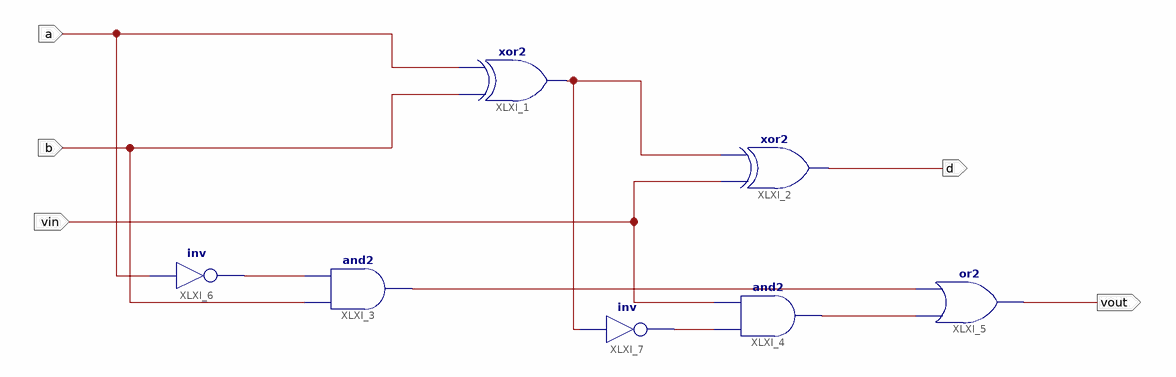
[diagram p0: schematic sheet 1]
// Xilinx ISE schematic optic.sch (spartan3e) as structural Verilog: 7 symbols, 5 ports
module optic (
  input  a,
  input  b,
  input  vin,
  output d,
  output vout
);

  wire XLXN_6, XLXN_8, XLXN_10, XLXN_11, XLXN_12;

  xor XLXI_1 (XLXN_10, b, a);
  xor XLXI_2 (d, vin, XLXN_10);
  and XLXI_3 (XLXN_8, b, XLXN_6);
  and XLXI_4 (XLXN_12, XLXN_11, vin);
  or XLXI_5 (vout, XLXN_12, XLXN_8);
  not XLXI_6 (XLXN_6, a);
  not XLXI_7 (XLXN_11, XLXN_10);
endmodule
